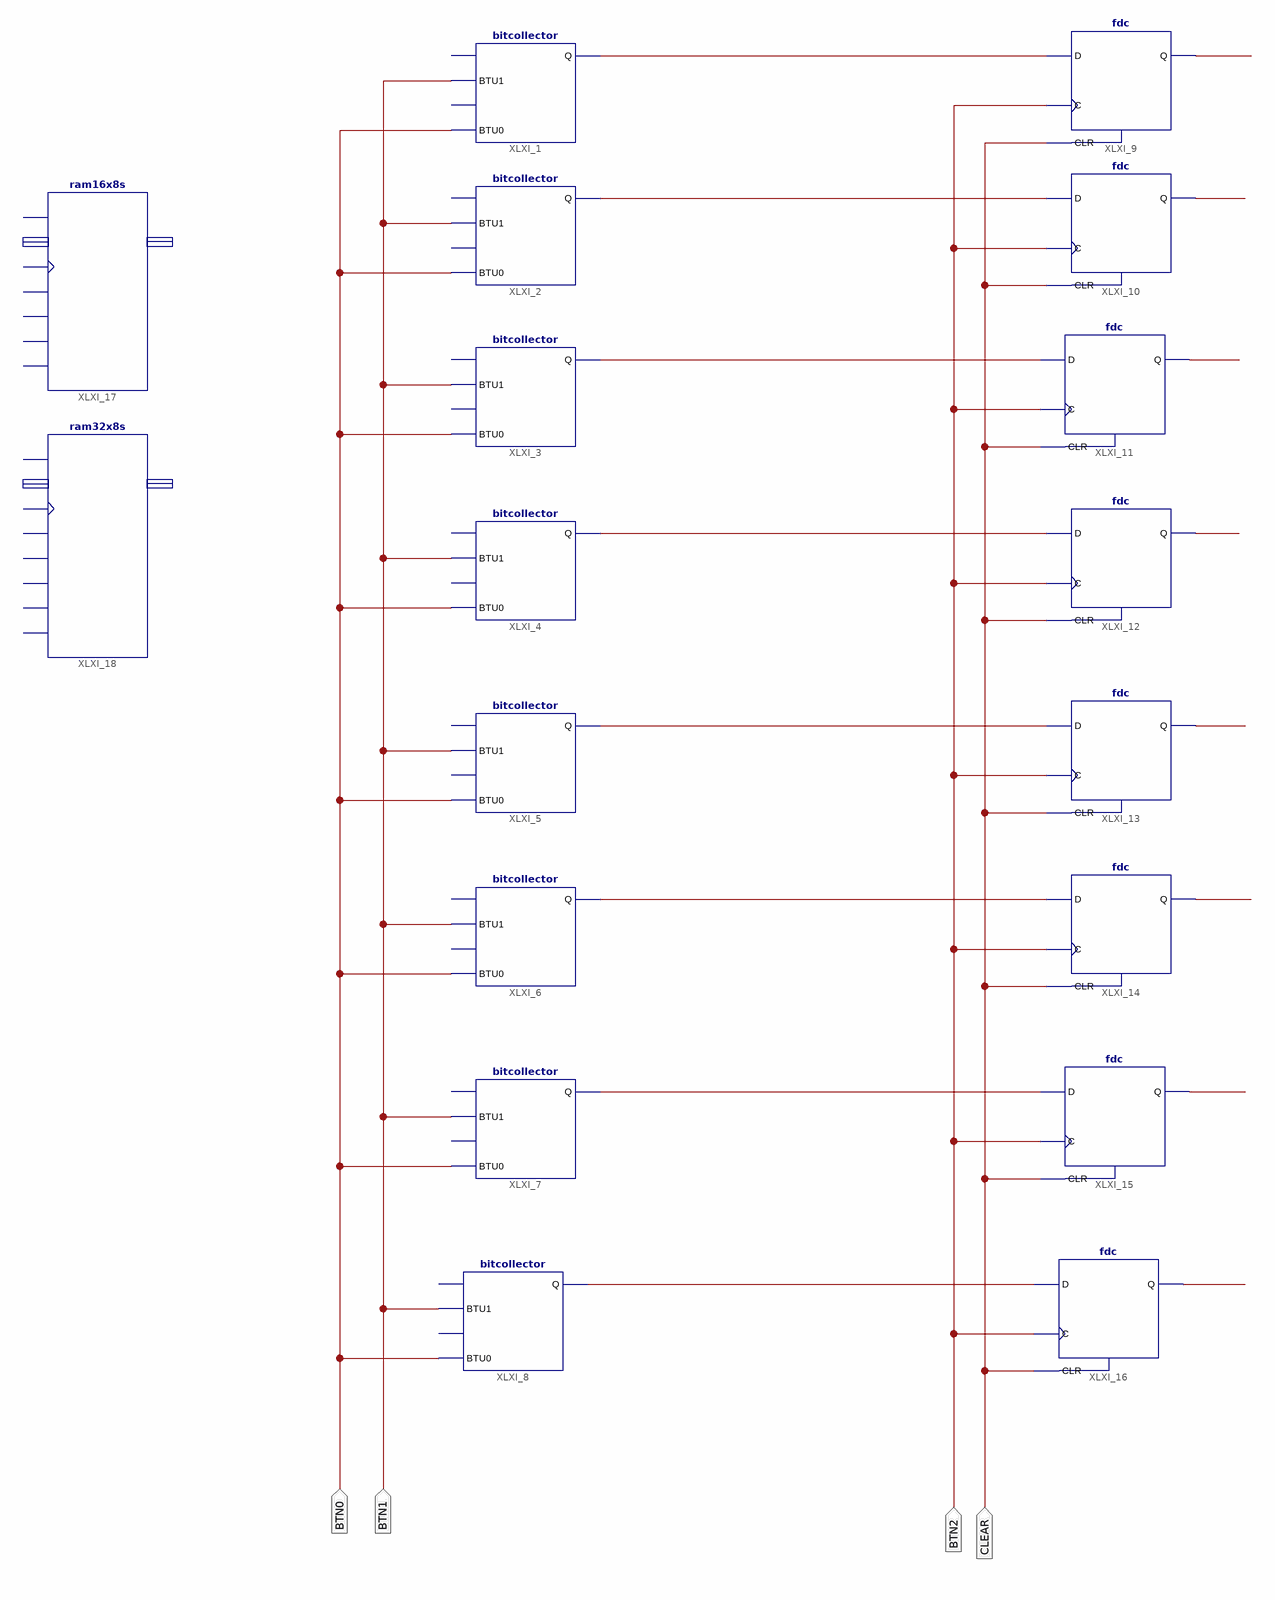
[diagram p0: schematic sheet 1]
// Xilinx ISE schematic third_re.sch (spartan3) as structural Verilog: 18 symbols, 4 ports
module third_re (
  input  CLEAR,
  input  BTN2,
  input  BTN1,
  input  BTN0
);

  wire XLXN_1, XLXN_2, XLXN_3, XLXN_4, XLXN_5, XLXN_6, XLXN_7, XLXN_8, XLXN_11, XLXN_12, XLXN_13, XLXN_14,
       XLXN_15, XLXN_16, XLXN_17, XLXN_18;

  bitcollector XLXI_1 (.BTU1(BTN1), .BTU0(BTN0), .Q(XLXN_1));  // open: Ddown, Dup
  bitcollector XLXI_2 (.BTU1(BTN1), .BTU0(BTN0), .Q(XLXN_2));  // open: Ddown, Dup
  bitcollector XLXI_3 (.BTU1(BTN1), .BTU0(BTN0), .Q(XLXN_3));  // open: Ddown, Dup
  bitcollector XLXI_4 (.BTU1(BTN1), .BTU0(BTN0), .Q(XLXN_4));  // open: Ddown, Dup
  bitcollector XLXI_5 (.BTU1(BTN1), .BTU0(BTN0), .Q(XLXN_5));  // open: Ddown, Dup
  bitcollector XLXI_6 (.BTU1(BTN1), .BTU0(BTN0), .Q(XLXN_6));  // open: Ddown, Dup
  bitcollector XLXI_7 (.BTU1(BTN1), .BTU0(BTN0), .Q(XLXN_7));  // open: Ddown, Dup
  bitcollector XLXI_8 (.BTU1(BTN1), .BTU0(BTN0), .Q(XLXN_8));  // open: Ddown, Dup
  fdc XLXI_9 (.C(BTN2), .CLR(CLEAR), .D(XLXN_1), .Q(XLXN_11));
  fdc XLXI_10 (.C(BTN2), .CLR(CLEAR), .D(XLXN_2), .Q(XLXN_12));
  fdc XLXI_11 (.C(BTN2), .CLR(CLEAR), .D(XLXN_3), .Q(XLXN_13));
  fdc XLXI_12 (.C(BTN2), .CLR(CLEAR), .D(XLXN_4), .Q(XLXN_14));
  fdc XLXI_13 (.C(BTN2), .CLR(CLEAR), .D(XLXN_5), .Q(XLXN_15));
  fdc XLXI_14 (.C(BTN2), .CLR(CLEAR), .D(XLXN_6), .Q(XLXN_16));
  fdc XLXI_15 (.C(BTN2), .CLR(CLEAR), .D(XLXN_7), .Q(XLXN_17));
  fdc XLXI_16 (.C(BTN2), .CLR(CLEAR), .D(XLXN_8), .Q(XLXN_18));
  ram16x8s XLXI_17 ();  // open: A0, A1, A2, A3, D, WCLK, WE, O
  ram32x8s XLXI_18 ();  // open: A0, A1, A2, A3, A4, D, WCLK, WE, O
endmodule
